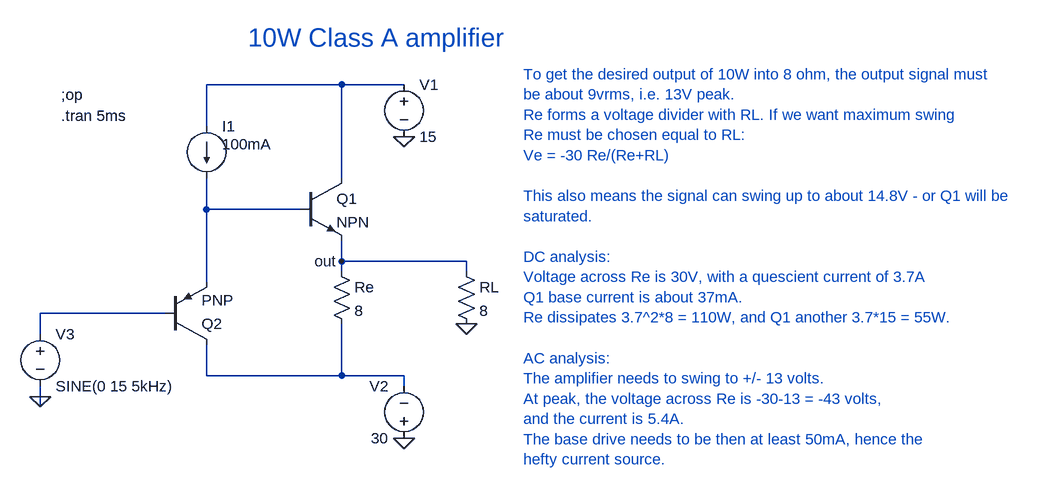
[diagram p0: schematic Figure2.54.asc]
Figure2.54.asc, the LTspice schematic file:
Version 4
SHEET 1 1700 680
WIRE 160 -64 -48 -64
WIRE 256 -64 160 -64
WIRE -48 0 -48 -64
WIRE 160 80 160 -64
WIRE -48 128 -48 80
WIRE 96 128 -48 128
WIRE 160 208 160 176
WIRE 352 208 160 208
WIRE 160 224 160 208
WIRE 352 224 352 208
WIRE -48 240 -48 128
WIRE -112 288 -304 288
WIRE -304 320 -304 288
WIRE -48 384 -48 336
WIRE 160 384 160 304
WIRE 160 384 -48 384
WIRE 256 384 160 384
WIRE 256 400 256 384
WIRE -304 416 -304 400
WIRE -304 432 -304 416
FLAG 256 16 0
FLAG 256 480 0
FLAG 352 304 0
FLAG -304 416 0
FLAG 160 208 out
SYMBOL voltage 256 -80 R0
WINDOW 123 0 0 Left 0
WINDOW 39 0 0 Left 0
SYMATTR InstName V1
SYMATTR Value 15
SYMBOL voltage 256 496 R180
WINDOW 0 24 96 Left 2
WINDOW 3 24 16 Left 2
WINDOW 123 0 0 Left 0
WINDOW 39 0 0 Left 0
SYMATTR InstName V2
SYMATTR Value 30
SYMBOL current -48 0 R0
WINDOW 3 24 28 Left 2
WINDOW 123 0 0 Left 0
WINDOW 39 0 0 Left 0
SYMATTR Value 100mA
SYMATTR InstName I1
SYMBOL npn 96 80 R0
SYMATTR InstName Q1
SYMBOL pnp -112 336 M180
SYMATTR InstName Q2
SYMBOL res 144 208 R0
SYMATTR InstName Re
SYMATTR Value 8
SYMBOL res 336 208 R0
SYMATTR InstName RL
SYMATTR Value 8
SYMBOL voltage -304 304 R0
WINDOW 123 0 0 Left 0
WINDOW 39 0 0 Left 0
SYMATTR InstName V3
SYMATTR Value SINE(0 15 5kHz)
TEXT -272 -48 Left 2 !;op
TEXT 16 -136 Left 4 ;10W Class A amplifier
TEXT 440 -80 Left 2 ;To get the desired output of 10W into 8 ohm, the output signal must \nbe about 9vrms, i.e. 13V peak.\nRe forms a voltage divider with RL. If we want maximum swing \nRe must be chosen equal to RL: \nVe = -30 Re/(Re+RL)\n \nThis also means the signal can swing up to about 14.8V - or Q1 will be \nsaturated.\n \nDC analysis:\nVoltage across Re is 30V, with a quescient current of 3.7A\nQ1 base current is about 37mA.\nRe dissipates 3.7^2*8 = 110W, and Q1 another 3.7*15 = 55W.\n \nAC analysis:\nThe amplifier needs to swing to +/- 13 volts. \nAt peak, the voltage across Re is -30-13 = -43 volts, \nand the current is 5.4A.\nThe base drive needs to be then at least 50mA, hence the \nhefty current source.
TEXT -272 -16 Left 2 !.tran 5ms

The netlist it stands for:
* Figure2.54.asc
V1 N001 0 15
V2 0 N004 30
I1 N001 N002 100mA
Q1 N001 N002 out 0 NPN
Q2 N004 N003 N002 0 PNP
Re out N004 8
RL out 0 8
V3 N003 0 SINE(0 15 5kHz)
.model NPN NPN
.model PNP PNP
.lib standard.bjt
;op
* 10W Class A amplifier
* To get the desired output of 10W into 8 ohm, the output signal must
* be about 9vrms, i.e. 13V peak.
* Re forms a voltage divider with RL. If we want maximum swing
* Re must be chosen equal to RL:
* Ve = -30 Re/(Re+RL)
* This also means the signal can swing up to about 14.8V - or Q1 will be
* saturated.
* DC analysis:
* Voltage across Re is 30V, with a quescient current of 3.7A
* Q1 base current is about 37mA.
* Re dissipates 3.7^2*8 = 110W, and Q1 another 3.7*15 = 55W.
* AC analysis:
* The amplifier needs to swing to +/- 13 volts.
* At peak, the voltage across Re is -30-13 = -43 volts,
* and the current is 5.4A.
* The base drive needs to be then at least 50mA, hence the
* hefty current source.
.tran 5ms
.backanno
.end